# Altium schematic sheet [30] - REVISION HISTORY.SchDoc
size A3; DocumentNumber: 30; SheetNumber: 30; SheetTotal: 31
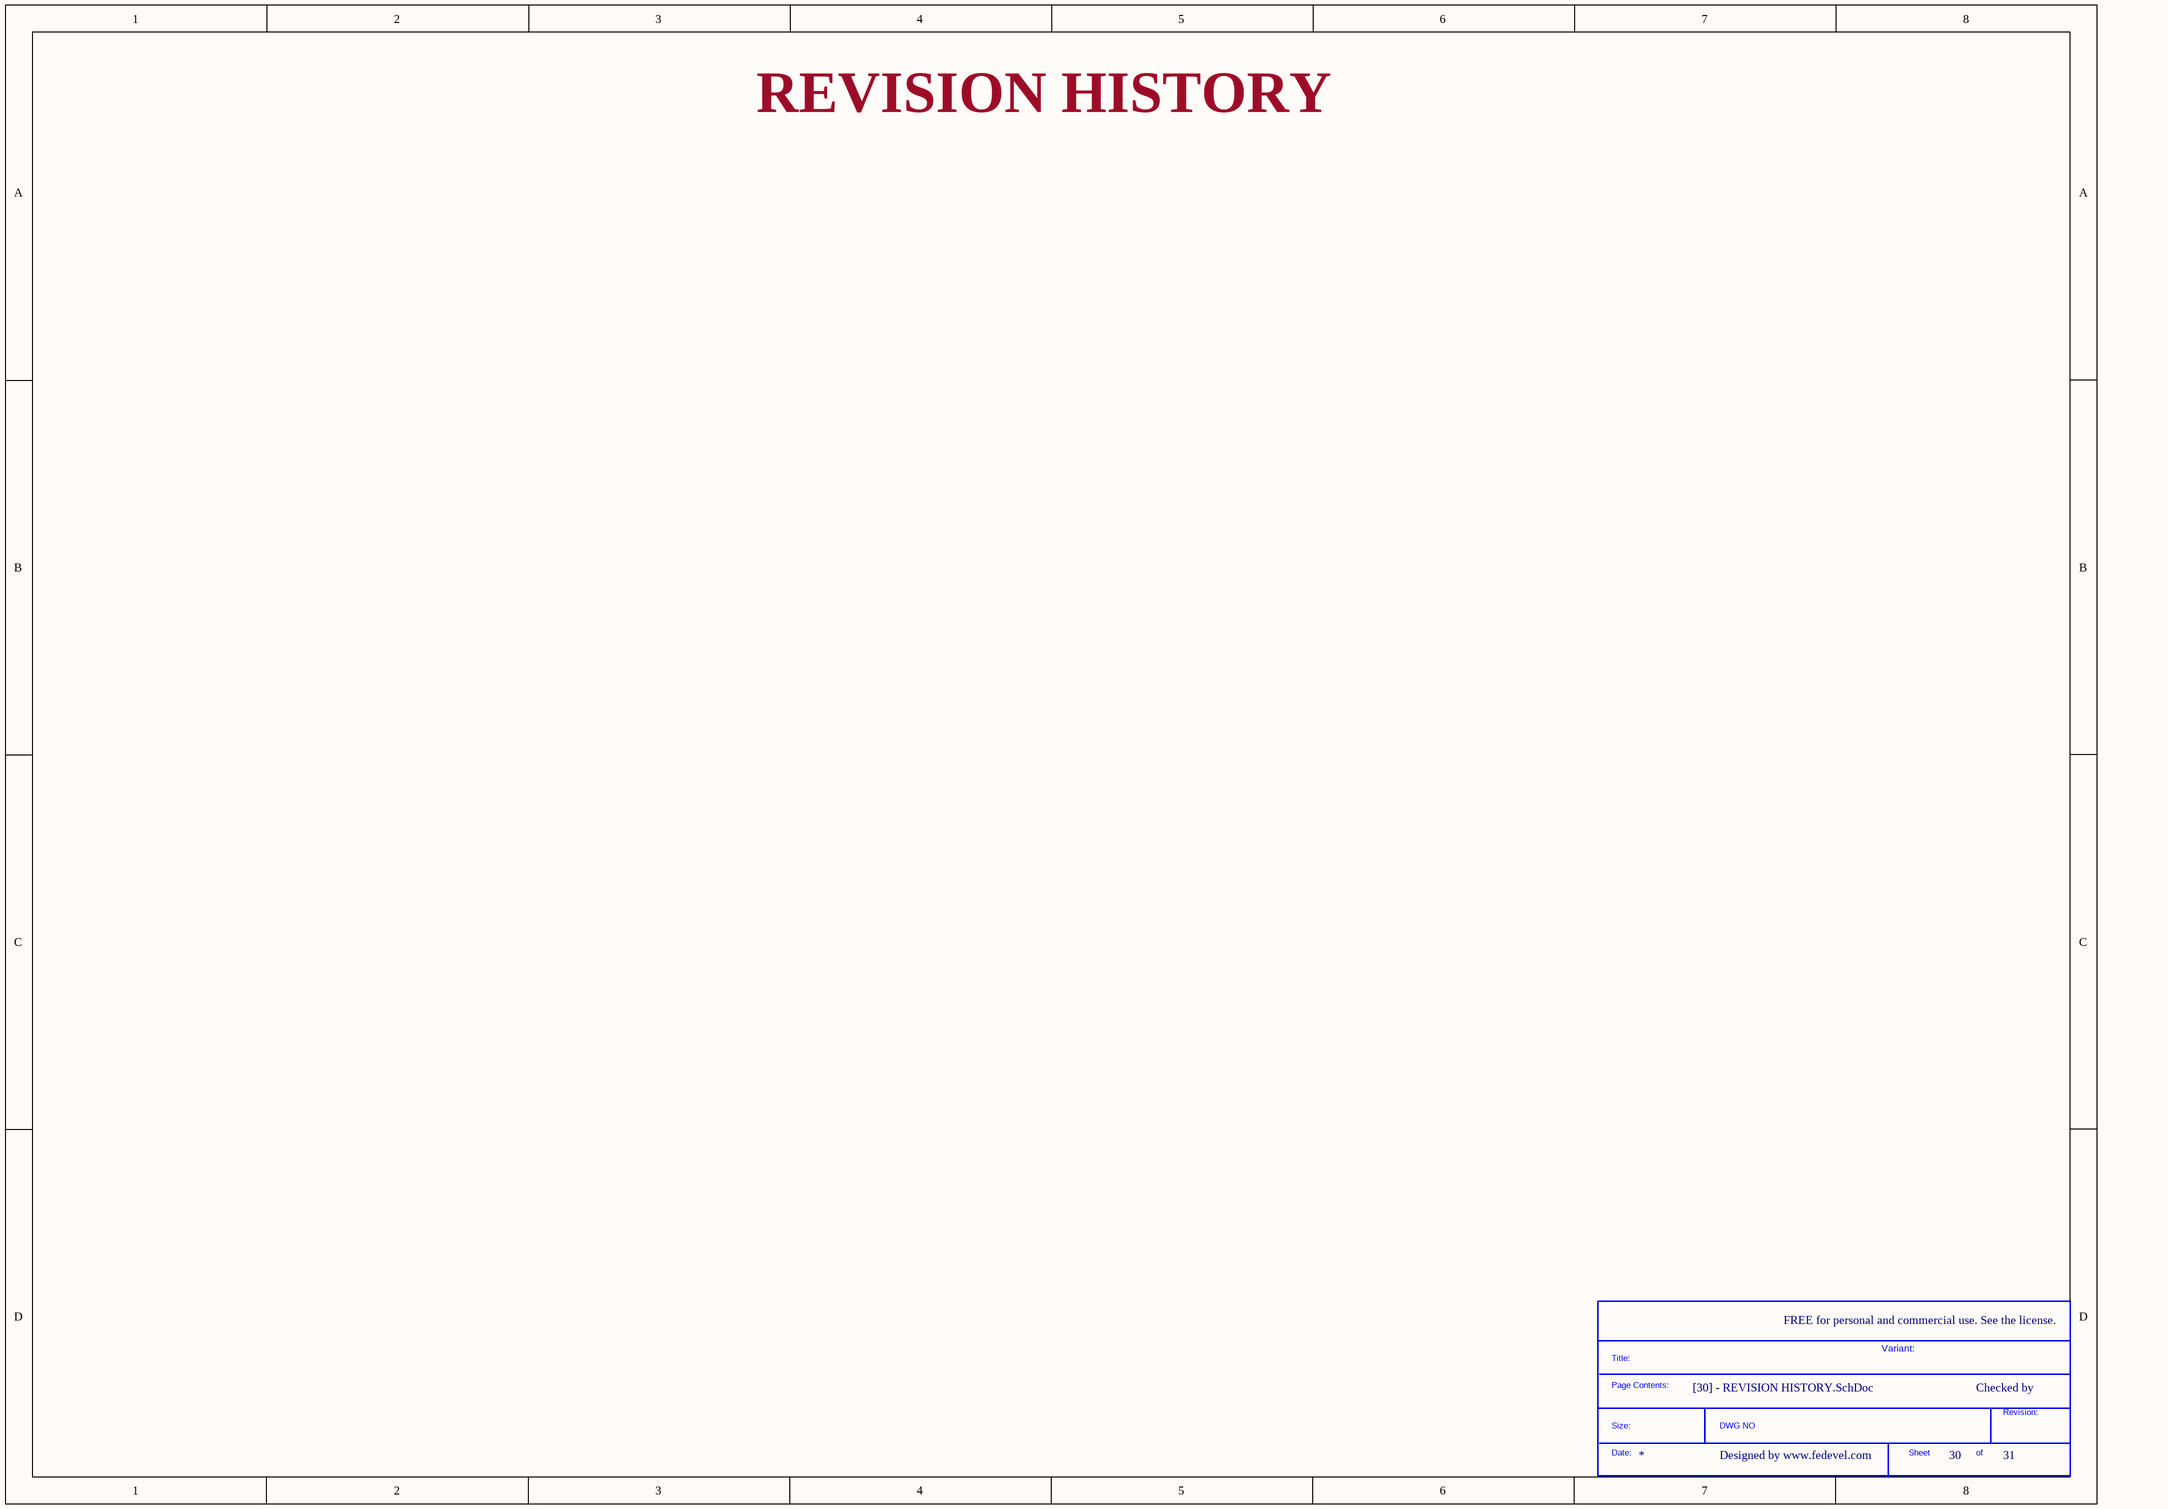
[diagram p0: [30] - REVISION HISTORY.SchDoc]

## Parts
*  SDTitleBlock  (value not drawn)  (graphical)

## Notes on the sheet
- REVISION HISTORY
- FREE for personal and commercial use. See the license.
- Variant:
- Checked by
- Designed by www.fedevel.com
- (in symbol SDTitleBlock) Title:; Page Contents:; Revision:; Size:; DWG NO; Date:; Sheet; of